# EAGLE design Atmega2560 (EAGLE 9.6.2)
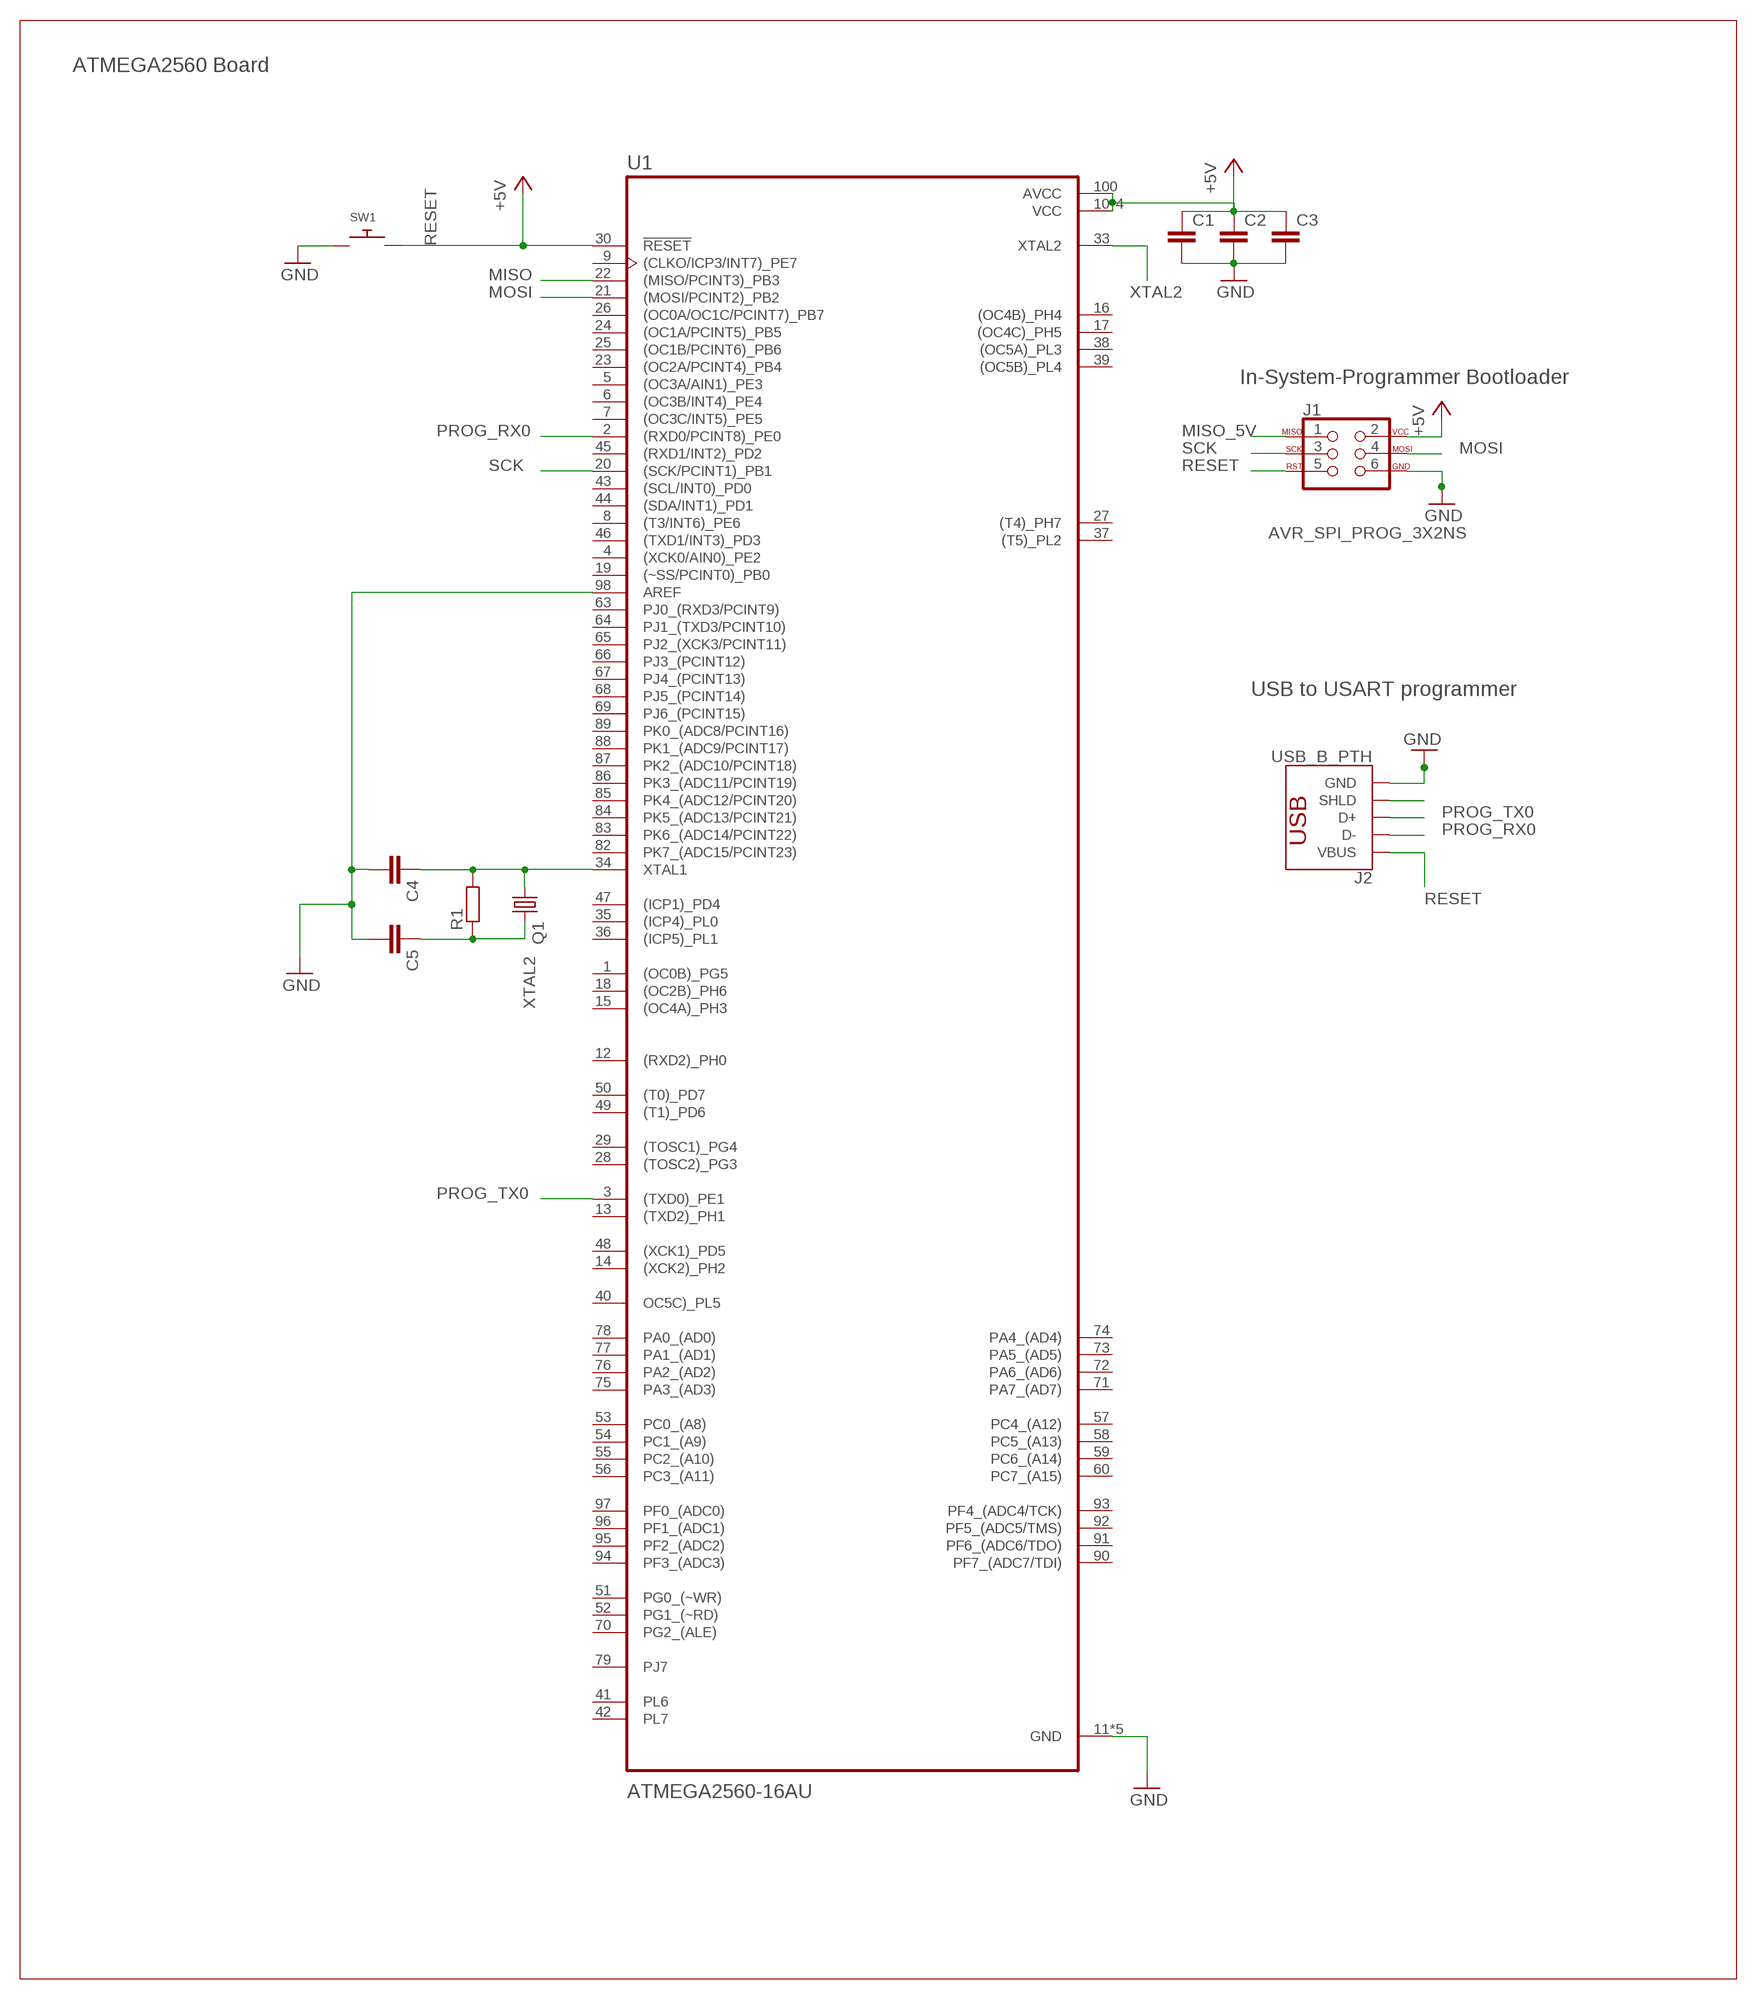
[diagram p0: schematic, sheet 1]

## Parts
C1  C-EUC0805  [C0805]
C2  C-EUC0805  [C0805]
C3  C-EUC0805  [C0805]
C4  C-EUC0805  [C0805]
C5  C-EUC0805  [C0805]
J1  AVR_SPI_PROG_3X2NS  [2X3-NS]
J2  USB_B_PTH  [USB-B-PTH]
Q1  CRYSTALHC49S  [HC49/S]
R1  R-EU_0207/10  [0207/10]
SW1  SWITCH_PUSHBUTTONEVQ-PE  [TACT_PANA-EVQ]
U1  ATMEGA2560-16AU  [QFP50P1600X1600X120-100N]

## Nets
+5V: C1.1 C2.1 C3.1 J1.2 U1.10(VCC) U1.31(VCC) U1.61(VCC) U1.80(VCC) U1.100(AVCC)
GND: C1.2 C2.2 C3.2 C4.2 C5.2 J1.6 J2.GND SW1.P$1 U1.11(GND) U1.32(GND) U1.62(GND) U1.81(GND) U1.98(AREF) U1.99(GND)
MISO: U1.22((MISO/PCINT3)_PB3)
MISO_5V: J1.1
MOSI: J1.4 U1.21((MOSI/PCINT2)_PB2)
N$1: C4.1 Q1.1 R1.2 U1.34(XTAL1)
N$5: J2.SHLD1(SHLD) J2.SHLD2(SHLD)
PROG_RX0: J2.D- U1.2((RXD0/PCINT8)_PE0)
PROG_TX0: J2.D+ U1.3((TXD0)_PE1)
RESET: J1.5 J2.VBUS SW1.P$2 U1.30(!RESET) ; supply symbol labelled +5V
SCK: J1.3 U1.20((SCK/PCINT1)_PB1)
XTAL2: C5.1 Q1.2 R1.1 U1.33(XTAL2)
Unconnected: U1.1((OC0B)_PG5) U1.4((XCK0/AIN0)_PE2) U1.5((OC3A/AIN1)_PE3) U1.6((OC3B/INT4)_PE4) U1.7((OC3C/INT5)_PE5) U1.8((T3/INT6)_PE6) U1.9((CLKO/ICP3/INT7)_PE7) U1.12((RXD2)_PH0) U1.13((TXD2)_PH1) U1.14((XCK2)_PH2) U1.15((OC4A)_PH3) U1.16((OC4B)_PH4) U1.17((OC4C)_PH5) U1.18((OC2B)_PH6) U1.19((~SS/PCINT0)_PB0) U1.23((OC2A/PCINT4)_PB4) U1.24((OC1A/PCINT5)_PB5) U1.25((OC1B/PCINT6)_PB6) U1.26((OC0A/OC1C/PCINT7)_PB7) U1.27((T4)_PH7) U1.28((TOSC2)_PG3) U1.29((TOSC1)_PG4) U1.35((ICP4)_PL0) U1.36((ICP5)_PL1) U1.37((T5)_PL2) U1.38((OC5A)_PL3) U1.39((OC5B)_PL4) U1.40(OC5C)_PL5) U1.41(PL6) U1.42(PL7) U1.43((SCL/INT0)_PD0) U1.44((SDA/INT1)_PD1) U1.45((RXD1/INT2)_PD2) U1.46((TXD1/INT3)_PD3) U1.47((ICP1)_PD4) U1.48((XCK1)_PD5) U1.49((T1)_PD6) U1.50((T0)_PD7) U1.51(PG0_(~WR)) U1.52(PG1_(~RD)) U1.53(PC0_(A8)) U1.54(PC1_(A9)) U1.55(PC2_(A10)) U1.56(PC3_(A11)) U1.57(PC4_(A12)) U1.58(PC5_(A13)) U1.59(PC6_(A14)) U1.60(PC7_(A15)) U1.63(PJ0_(RXD3/PCINT9)) U1.64(PJ1_(TXD3/PCINT10)) U1.65(PJ2_(XCK3/PCINT11)) U1.66(PJ3_(PCINT12)) U1.67(PJ4_(PCINT13)) U1.68(PJ5_(PCINT14)) U1.69(PJ6_(PCINT15)) U1.70(PG2_(ALE)) U1.71(PA7_(AD7)) U1.72(PA6_(AD6)) U1.73(PA5_(AD5)) U1.74(PA4_(AD4)) U1.75(PA3_(AD3)) U1.76(PA2_(AD2)) U1.77(PA1_(AD1)) U1.78(PA0_(AD0)) U1.79(PJ7) U1.82(PK7_(ADC15/PCINT23)) U1.83(PK6_(ADC14/PCINT22)) U1.84(PK5_(ADC13/PCINT21)) U1.85(PK4_(ADC12/PCINT20)) U1.86(PK3_(ADC11/PCINT19)) U1.87(PK2_(ADC10/PCINT18)) U1.88(PK1_(ADC9/PCINT17)) U1.89(PK0_(ADC8/PCINT16)) U1.90(PF7_(ADC7/TDI)) U1.91(PF6_(ADC6/TDO)) U1.92(PF5_(ADC5/TMS)) U1.93(PF4_(ADC4/TCK)) U1.94(PF3_(ADC3)) U1.95(PF2_(ADC2)) U1.96(PF1_(ADC1)) U1.97(PF0_(ADC0))

## Notes on the sheet
- ATMEGA2560 Board
- In-System-Programmer Bootloader
- USB to USART programmer

## Library data of the parts
C1-C5 = rcl:C-EU: CAPACITOR, European symbol; SPICEPREFIX: C
J1 = SparkFun-Connectors:AVR_SPI_PROG_3X2: AVR ISP 6 Pin This is the reduced ISP connector for AVR programming. Common on Arduino. This footprint will take up less PCB space and can be used with a 10-pin to 6-pin adapter such as SKU: BOB-08508 **Special note about "TEST_POINT" package. The stop mask is on the top side, so if you want your programming test points to be on the bottom of your board, make sure to place this package on the bottom side of the board. This also ensure that the orientation to program from the bottom side will be correct. SparkFun Products: SparkFun ISP Pogo Adapter <https://www.sparkfun.com/products/11591> - NS Tiny AVR Programmer <https://www.sparkfun.com/products/11801> -PTH
J2 = SparkFun-Connectors:USB_B: USB Type B Connector SparkFun Products: SparkFun Stepoko <https://www.sparkfun.com/products/13899> PTH; PROD_ID: CONN-08278; SF_ID: PRT-00139
Q1 = crystal:CRYSTAL: CRYSTAL; OC_FARNELL: 1667008; OC_NEWARK: unknown
R1 = rcl:R-EU_: RESISTOR, European symbol; SPICEPREFIX: R
SW1 = adafruit:SWITCH_PUSHBUTTON: Buttons SOFTTOUCHSMD_SJ - Soft touch temporary push button (Super Junk Akihabara) Compatible with SKPMANE010 [Mouser: 688-SKPMAN] C&K_KSS = Digikey: KSS221GLFS
U1 = ATMEGA2560-16AU:ATMEGA2560-16AU: Check prices <https://pricing.snapeda.com/parts/ATMEGA2560-16AU/Microchip%20Technology/view-part?ref=eda>; AVAILABILITY: Good; DESCRIPTION: IC MCU 8BIT 256KB FLASH 100TQFP; MF: Microchip Technology; MP: ATMEGA2560-16AU; PACKAGE: None; PRICE: None; PURCHASE-URL: https://pricing.snapeda.com/search/part/ATMEGA2560-16AU/?ref=eda

## Board
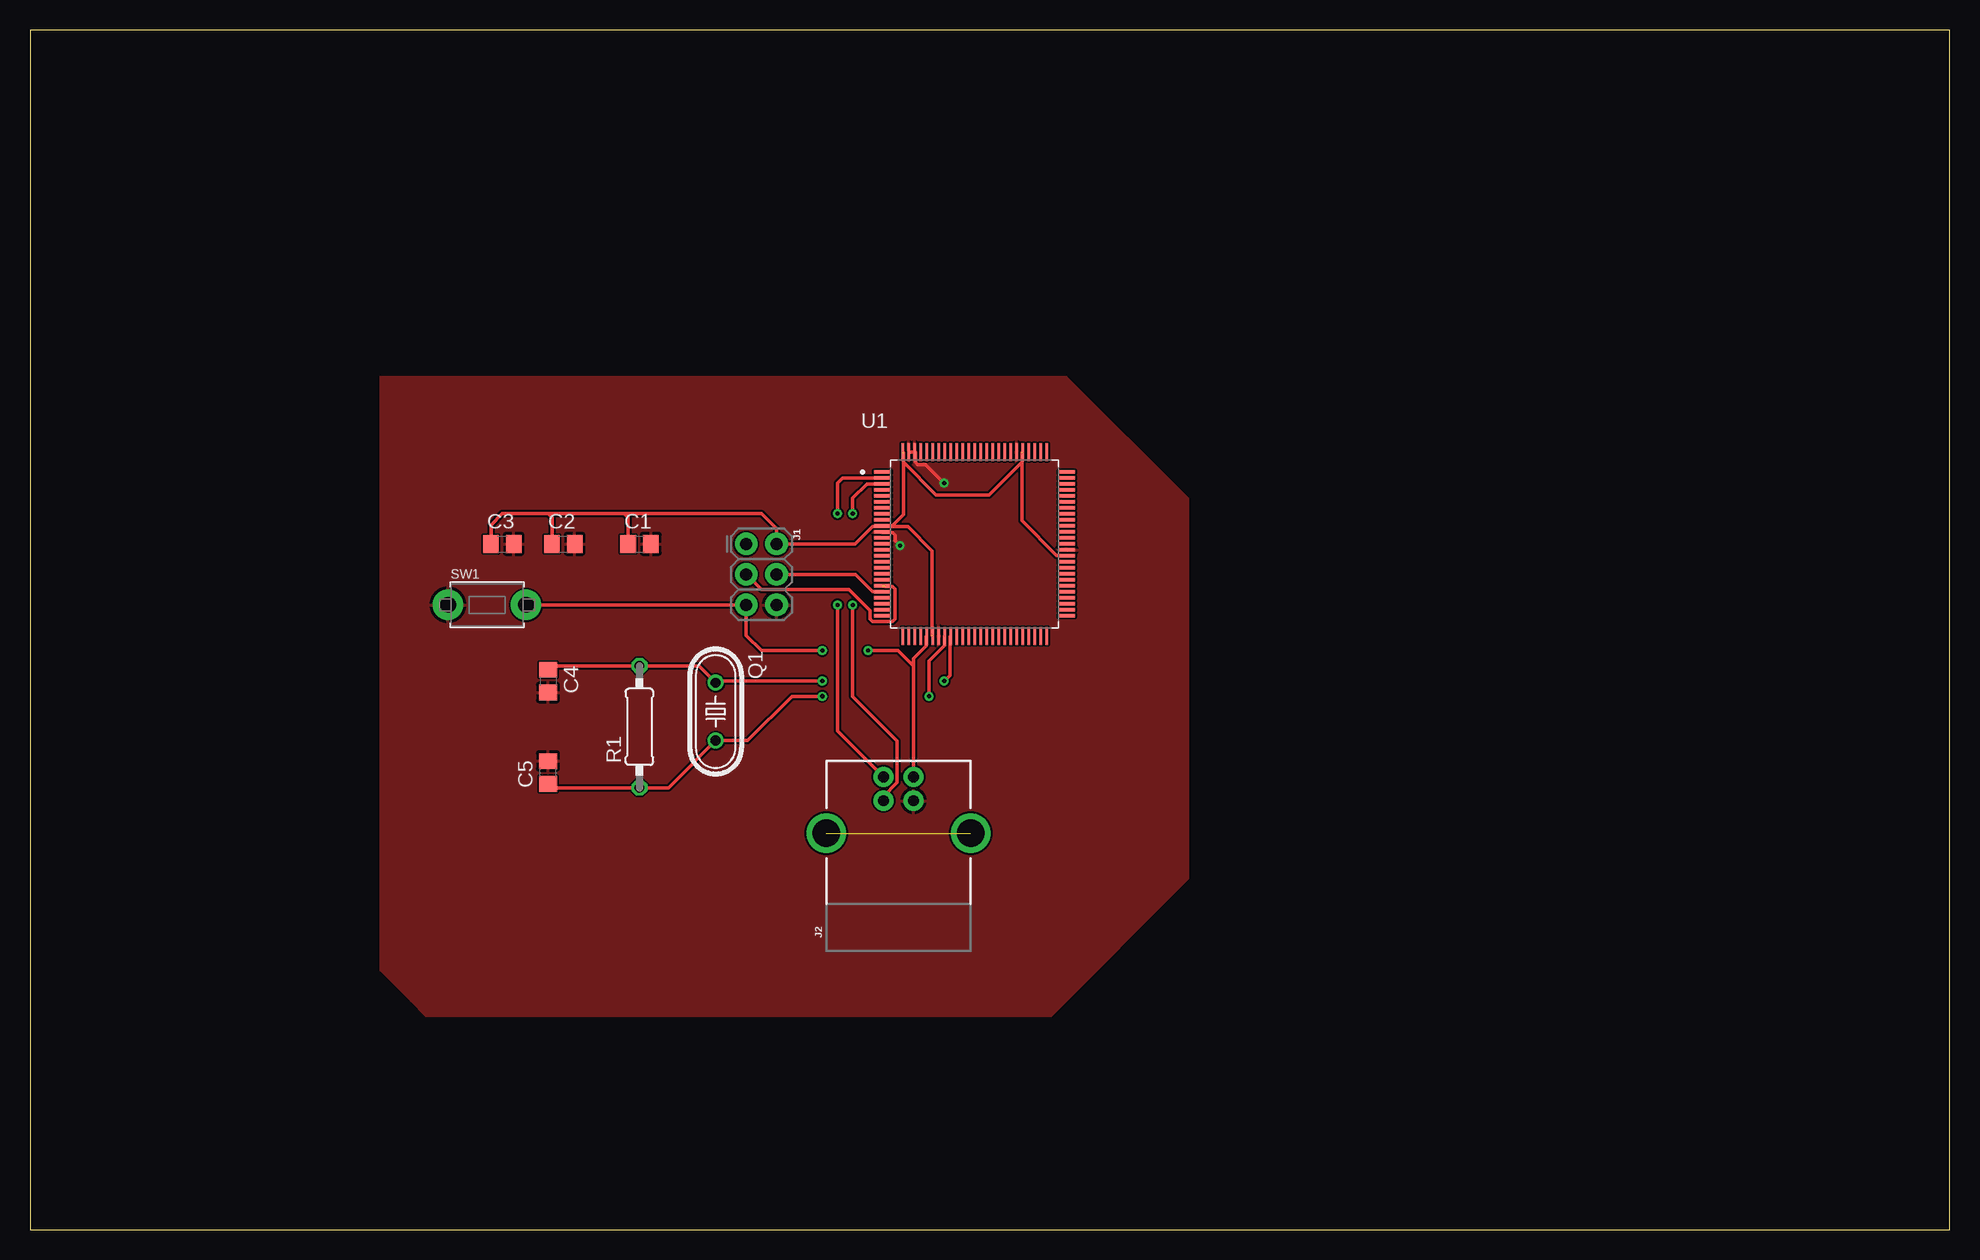
[diagram p1: board, top side]
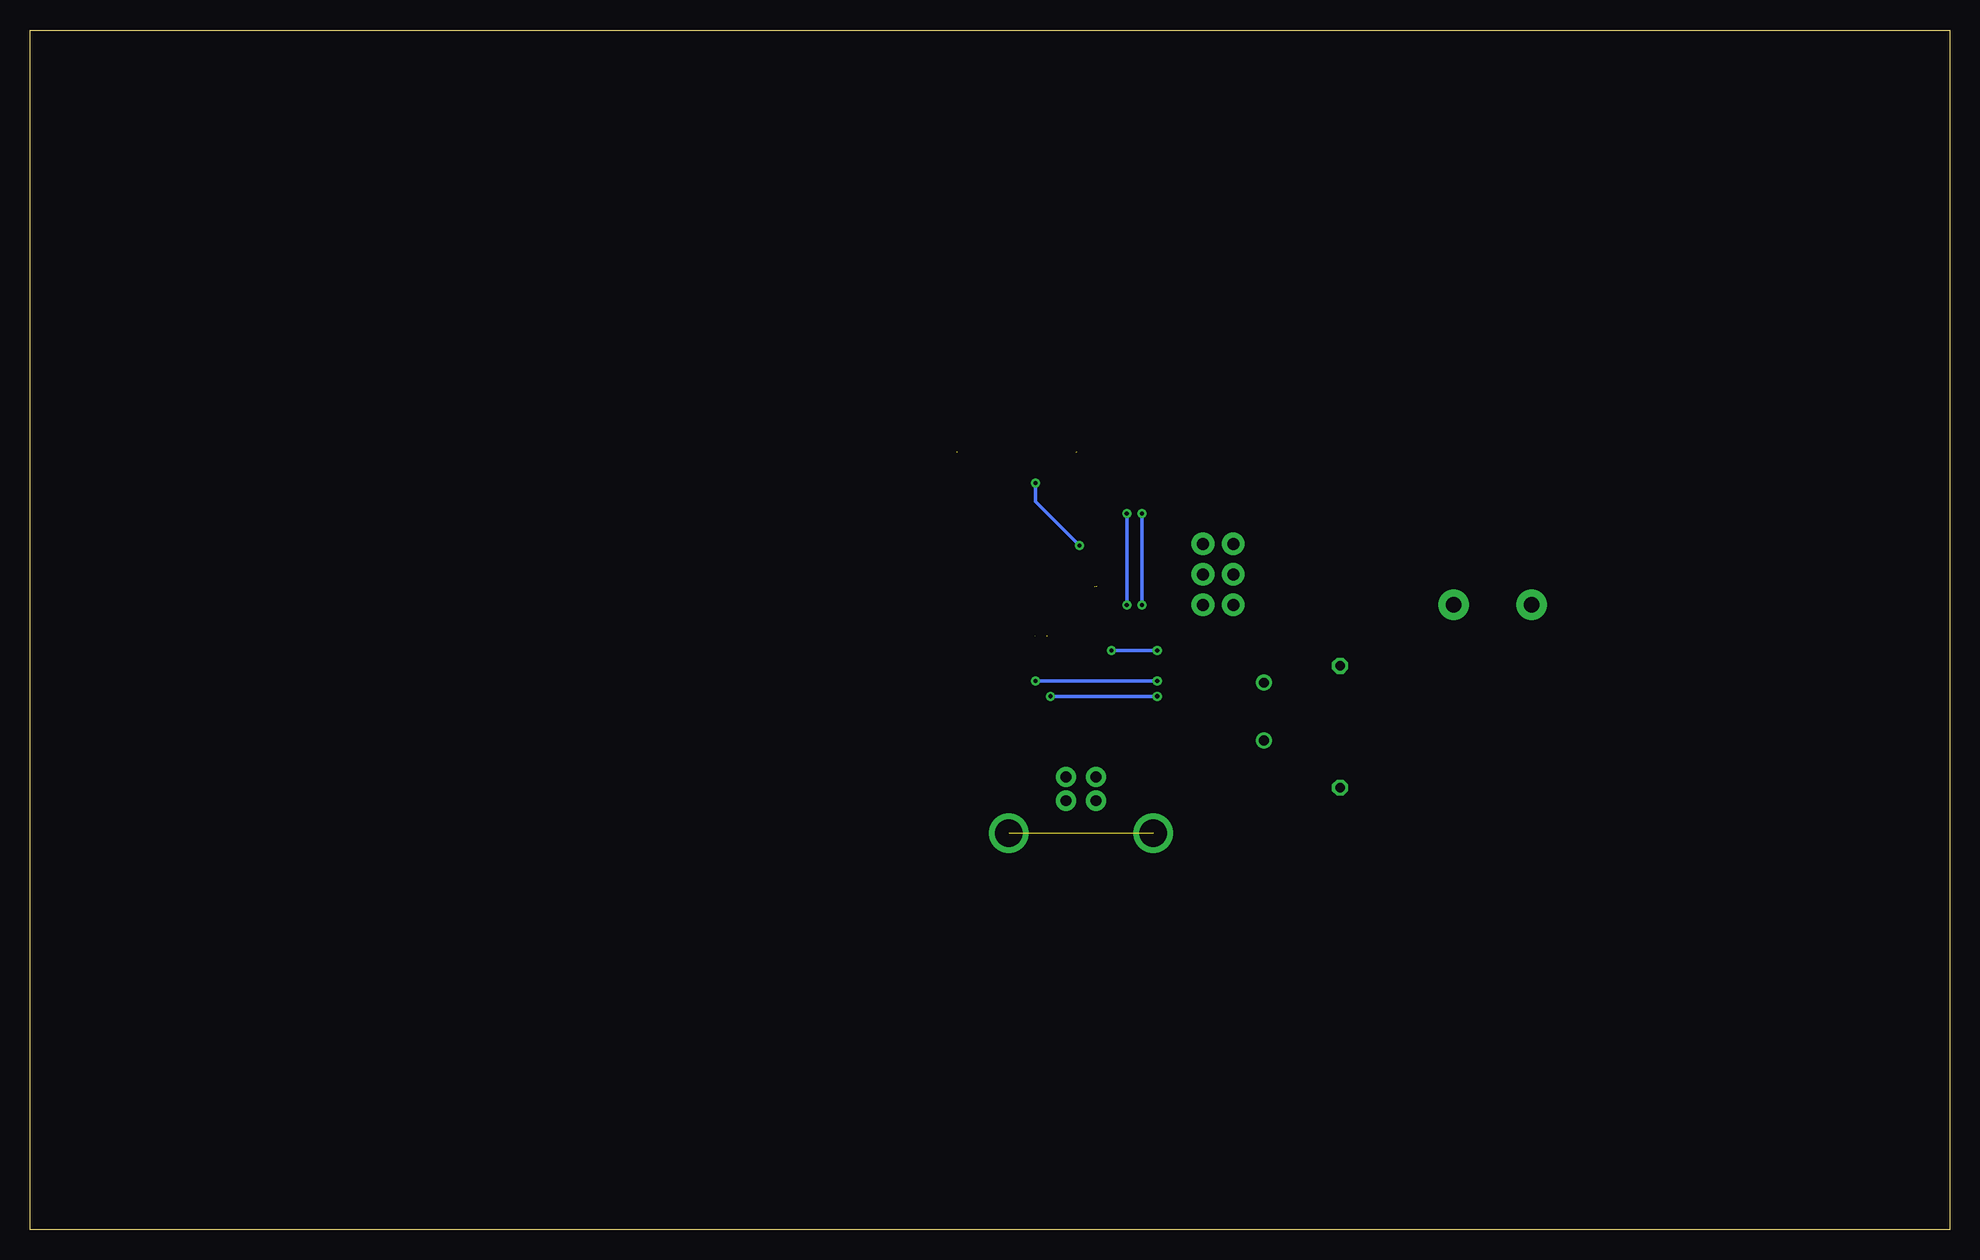
[diagram p2: board, bottom side, seen from below]

Size 160 x 100 mm. Coordinates in mm from the lower left corner, seen from the top.
Outline: 0,0 160,0 160,100 0,100 0,0
Copper layers (1*16): Top 0.035mm / dielectric 1.5mm / Bottom 0.035mm
Design rules "default": minimum track width 6mil, minimum drill 0.35mm, track to track 6mil, track to pad 6mil, pad to pad 6mil, via to via 6mil, smd to smd 6mil, copper to edge 40mil, drill to drill 6mil, minimum pad ring 10mil, minimum via ring 8mil, stop-mask expansion 4mil, vias tented up to drill 0mil, thermal gap 10mil

### Footprints (pad centres in the part's own frame; a part is rotated, then mirrored left to right if it is on the bottom)
C0805 = smd 1.3 x 1.5: 1 -0.95,0; 2 0.95,0
2X3-NS = drill 1.016 pad 1.88: 1 -2.54,-1.27; 2 -2.54,1.27; 3 0,-1.27; 4 0,1.27; 5 2.54,-1.27; 6 2.54,1.27
USB-B-PTH = drill 0.914 pad 1.676: D+ 4,1.25; D- 5.981,1.25; GND 4,-1.25; VBUS 5.981,-1.25 | drill 2.286: SHLD1 1.282,-6.02; SHLD2 1.282,6.02
HC49/S = drill 0.813: 1 -2.413,0; 2 2.413,0
0207/10 = drill 0.813 octagon: 1 -5.08,0; 2 5.08,0
TACT_PANA-EVQ = drill 1.3 pad 2.54: P$1 -3.25,0; P$2 3.25,0
QFP50P1600X1600X120-100N = smd 1.47 x 0.28: 1 -7.67,6; 2 -7.67,5.5; 3 -7.67,5; 4 -7.67,4.5; 5 -7.67,4; 6 -7.67,3.5; 7 -7.67,3; 8 -7.67,2.5; 9 -7.67,2; 10 -7.67,1.5; 11 -7.67,1; 12 -7.67,0.5; 13 -7.67,0; 14 -7.67,-0.5; 15 -7.67,-1; 16 -7.67,-1.5; 17 -7.67,-2; 18 -7.67,-2.5; 19 -7.67,-3; 20 -7.67,-3.5; 21 -7.67,-4; 22 -7.67,-4.5; 23 -7.67,-5; 24 -7.67,-5.5; 25 -7.67,-6; 51 7.67,-6; 52 7.67,-5.5; 53 7.67,-5; 54 7.67,-4.5; 55 7.67,-4; 56 7.67,-3.5; 57 7.67,-3; 58 7.67,-2.5; 59 7.67,-2; 60 7.67,-1.5; 61 7.67,-1; 62 7.67,-0.5; 63 7.67,0; 64 7.67,0.5; 65 7.67,1; 66 7.67,1.5; 67 7.67,2; 68 7.67,2.5; 69 7.67,3; 70 7.67,3.5; 71 7.67,4; 72 7.67,4.5; 73 7.67,5; 74 7.67,5.5; 75 7.67,6 | smd 0.28 x 1.47: 26 -6,-7.67; 27 -5.5,-7.67; 28 -5,-7.67; 29 -4.5,-7.67; 30 -4,-7.67; 31 -3.5,-7.67; 32 -3,-7.67; 33 -2.5,-7.67; 34 -2,-7.67; 35 -1.5,-7.67; 36 -1,-7.67; 37 -0.5,-7.67; 38 0,-7.67; 39 0.5,-7.67; 40 1,-7.67; 41 1.5,-7.67; 42 2,-7.67; 43 2.5,-7.67; 44 3,-7.67; 45 3.5,-7.67; 46 4,-7.67; 47 4.5,-7.67; 48 5,-7.67; 49 5.5,-7.67; 50 6,-7.67; 76 6,7.67; 77 5.5,7.67; 78 5,7.67; 79 4.5,7.67; 80 4,7.67; 81 3.5,7.67; 82 3,7.67; 83 2.5,7.67; 84 2,7.67; 85 1.5,7.67; 86 1,7.67; 87 0.5,7.67; 88 0,7.67; 89 -0.5,7.67; 90 -1,7.67; 91 -1.5,7.67; 92 -2,7.67; 93 -2.5,7.67; 94 -3,7.67; 95 -3.5,7.67; 96 -4,7.67; 97 -4.5,7.67; 98 -5,7.67; 99 -5.5,7.67; 100 -6,7.67

### Placement (x,y rotation side)
C1  50.8,57.15 0 top
C2  44.45,57.15 0 top
C3  39.37,57.15 0 top
C4  43.18,45.72 270 top
C5  43.18,38.1 90 top
J1  60.96,54.61 270 top
J2  72.39,31.75 90 top
Q1  57.15,43.18 270 top
R1  50.8,41.91 90 top
SW1  38.1,52.07 0 top
U1  78.74,57.15 0 top

### Tracks (layer width: path | path; a pad name or v marks a point on that pad's centre or on a via)
+5V  (3 unrouted)
  Top 0.305: U1.10 71.02,58.59 70.23,58.59 68.78,57.15 J1.2 62.23,58.42 60.96,59.69 49.53,59.69 | U1.10 71.12,58.59 73.18,58.59 75.2,56.58 75.2,49.53 | U1.10 71.12,58.7 71.91,58.7 72.8,59.59 72.8,63.98 | 72.8,64.77 72.8,63.98 | 72.8,63.98 75.53,61.24 79.95,61.24 82.69,63.98 | 82.69,64.77 82.69,63.98 | U1.61 86.36,56.2 85.57,56.2 82.69,59.09 82.69,63.98 | C3.1 38.42,58.74 39.37,59.69 43.18,59.69 | 43.18,59.69 43.5,59.37 C2.1 | 43.18,59.69 49.53,59.69 | 49.53,59.69 49.85,59.37 C1.1
GND  (via drill 0.35)
  Top 0.305: 73.25,64.82 U1.98 73.8,64.77 73.8,63.98 73.99,63.78 74.65,63.78 v76.2,62.23 | 71.12,58.09 71.91,58.09 72.11,57.9 72.11,57.43 v72.52,57.02
  Bottom 0.305: v76.2,62.23 76.2,60.71 v72.52,57.02
  pour Top: 29.21,71.12 86.36,71.12 96.52,60.96 96.52,29.21 85.09,17.78 33.02,17.78 31.75,19.05 29.21,21.59
MOSI
  Top 0.305: U1.21 71.02,53.2 70.23,53.2 68.82,54.61 J1.4
N$1  (via drill 0.35)
  Top 0.305: C4.1 43.5,46.99 R1.2 55.75,46.99 Q1.1 57.28,45.72 v66.04,45.72 | U1.34 76.69,49.42 76.69,46.2 v76.2,45.72
  Bottom 0.305: v66.04,45.72 v76.2,45.72
N$5  (1 unrouted)
PROG_RX0  (via drill 0.35)
  Top 0.305: J2.D- 67.31,41.56 v67.31,52.07 | v67.31,59.69 67.31,62.23 67.73,62.65 U1.2
  Bottom 0.305: v67.31,52.07 v67.31,59.69
PROG_TX0  (via drill 0.35)
  Top 0.305: J2.D+ 71.14,36.12 72.28,37.26 72.28,40.75 68.58,44.45 v68.58,52.07 | v68.58,59.69 68.58,60.96 69.77,62.15 U1.3
  Bottom 0.305: v68.58,52.07 v68.58,59.69
RESET  (via drill 0.35)
  Top 0.305: U1.30 74.69,49.42 74.69,48.64 73.64,47.59 73.64,46.99 | J2.VBUS 73.64,46.99 | SW1.P$2 J1.5 59.69,49.53 60.96,48.26 v66.04,48.26 | v69.85,48.26 72.37,48.26 73.64,46.99
  Bottom 0.305: v66.04,48.26 v69.85,48.26
SCK  (1 unrouted)
  Top 0.305: J1.3 60.96,53.34 68.28,53.34 70.03,51.59 70.03,50.9 70.23,50.7 71.91,50.7 72.11,50.9 72.11,53.4 71.91,53.59 71.27,53.59
XTAL2  (via drill 0.35)  (1 unrouted)
  Top 0.305: C5.1 43.5,36.83 R1.1 53.21,36.83 Q1.2 59.82,40.77 63.5,44.45 v66.04,44.45 | v74.93,44.45 74.93,47.38 76.23,48.68 76.23,49.48
  Bottom 0.305: v66.04,44.45 v74.93,44.45